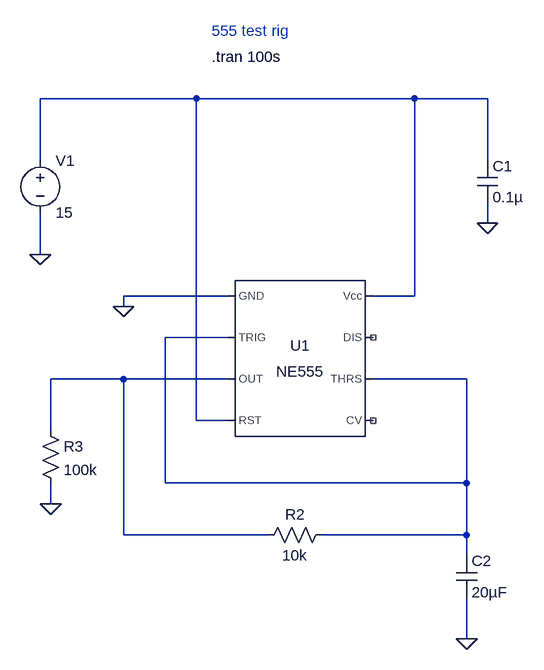
[diagram p0: schematic LM555_test_jig.asc]
LM555_test_jig.asc, the LTspice schematic file:
Version 4
SHEET 1 1268 852
WIRE 496 0 256 0
WIRE 832 0 496 0
WIRE 944 0 832 0
WIRE 256 96 256 0
WIRE 944 96 944 0
WIRE 944 192 944 160
WIRE 256 240 256 176
WIRE 544 304 384 304
WIRE 832 304 832 0
WIRE 832 304 768 304
WIRE 384 320 384 304
WIRE 544 368 448 368
WIRE 384 432 272 432
WIRE 544 432 384 432
WIRE 912 432 768 432
WIRE 496 496 496 0
WIRE 544 496 496 496
WIRE 272 512 272 432
WIRE 448 592 448 368
WIRE 912 592 912 432
WIRE 912 592 448 592
WIRE 272 624 272 592
WIRE 384 672 384 432
WIRE 608 672 384 672
WIRE 912 672 912 592
WIRE 912 672 688 672
WIRE 912 704 912 672
WIRE 912 832 912 768
FLAG 912 832 0
FLAG 272 624 0
FLAG 384 320 0
FLAG 256 240 0
FLAG 944 192 0
SYMBOL voltage 256 80 R0
WINDOW 123 0 0 Left 2
WINDOW 39 0 0 Left 2
SYMATTR InstName V1
SYMATTR Value 15
SYMBOL Misc\\NE555 656 400 R0
SYMATTR InstName U1
SYMBOL cap 896 704 R0
SYMATTR InstName C2
SYMATTR Value 20µF
SYMBOL res 704 656 R90
WINDOW 0 0 56 VBottom 2
WINDOW 3 32 56 VTop 2
SYMATTR InstName R2
SYMATTR Value 10k
SYMBOL res 256 496 R0
SYMATTR InstName R3
SYMATTR Value 100k
SYMBOL cap 928 96 R0
SYMATTR InstName C1
SYMATTR Value 0.1µ
TEXT 520 -104 Left 2 ;555 test rig
TEXT 520 -64 Left 2 !.tran 100s

The netlist it stands for:
* LM555_test_jig.asc
V1 N001 0 15
XU1 0 N002 N003 N001 NC_01 N002 NC_02 N001 NE555  ; pins GND TRIG OUT RST CV THRS DIS Vcc
C2 N002 0 20µF
R2 N002 N003 10k
R3 N003 0 100k
C1 N001 0 0.1µ
* 555 test rig
.tran 100s
.lib NE555.sub
.backanno
.end